# EAGLE design BLE_test (EAGLE 7.5.0)
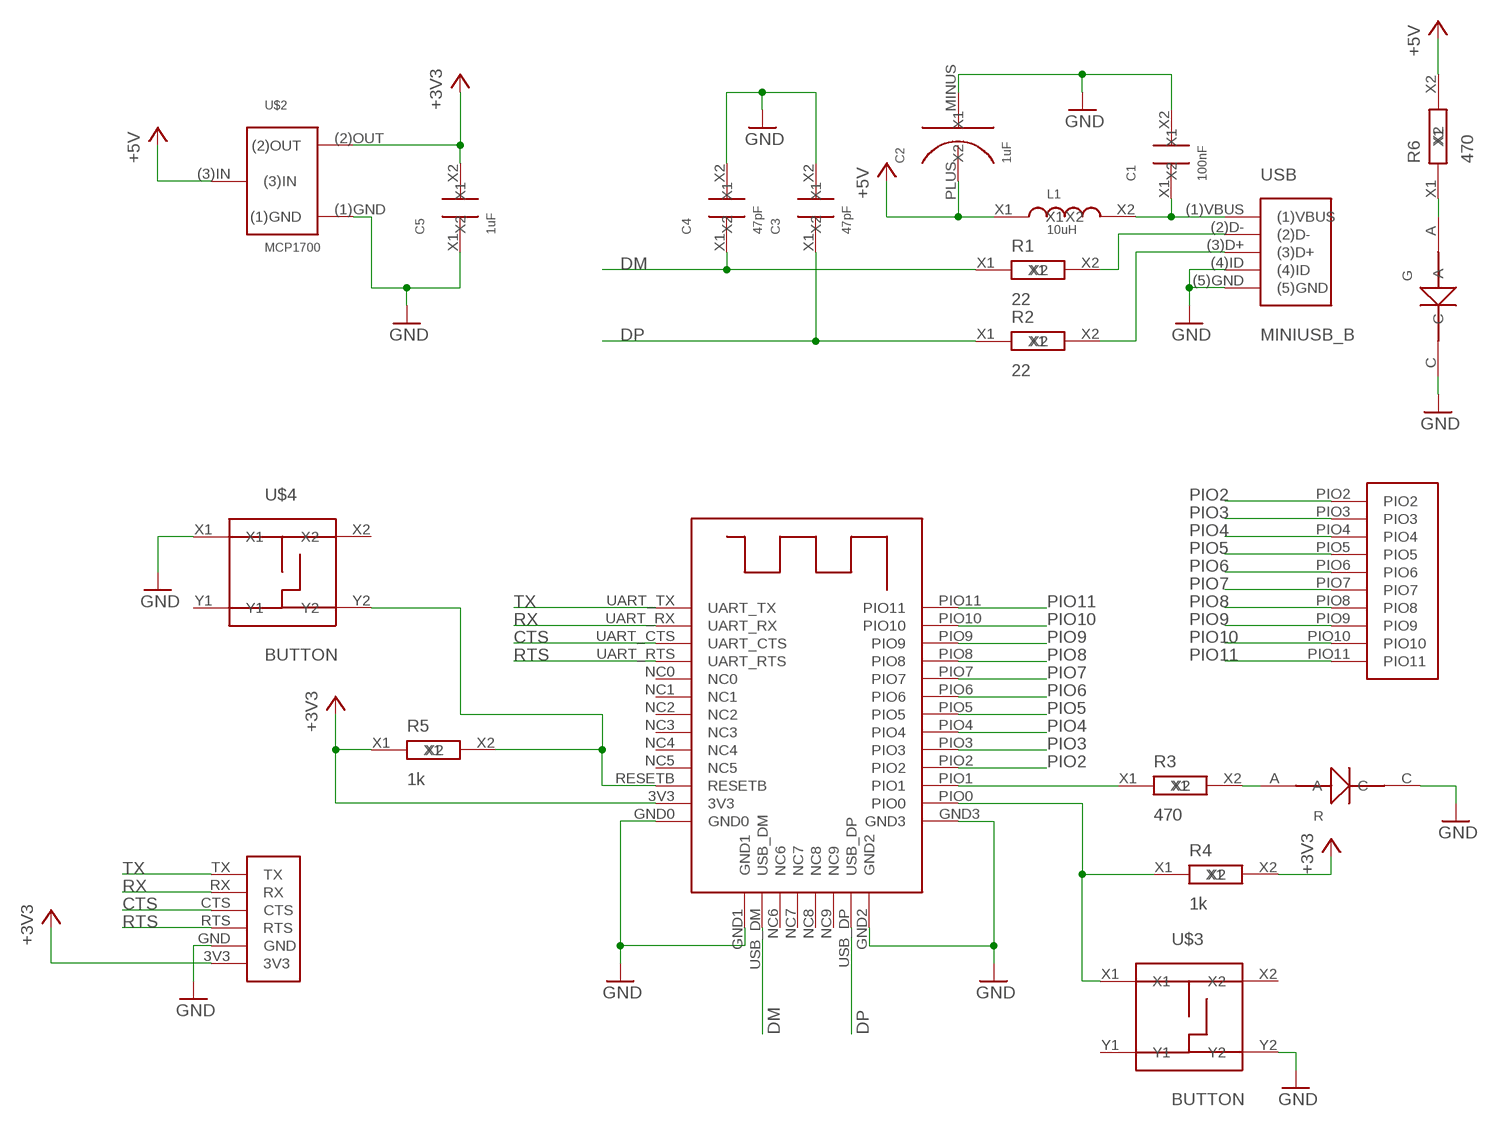
[diagram p0: schematic, sheet 1]

## Parts
C1  100nF  C_SMD_2.1X1.25  [SMD_2.1X1.25]
C2  1uF  C_SMD_TA_A  [C_SMD_TA_A]
C3  47pF  C_SMD_2.1X1.25  [SMD_2.1X1.25]
C4  47pF  C_SMD_2.1X1.25  [SMD_2.1X1.25]
C5  1uF  C_SMD_2.1X1.25  [SMD_2.1X1.25]
G  LED0805  [SMD0805]
L1  10uH  L_SMD_2.1X1.25  [SMD_2.1X1.25]
R  LED0805  [SMD0805]
R1  22  R_SMD_2.1X1.25  [SMD_2.1X1.25]
R2  22  R_SMD_2.1X1.25  [SMD_2.1X1.25]
R3  470  R_SMD_2.1X1.25  [SMD_2.1X1.25]
R4  1k  R_SMD_2.1X1.25  [SMD_2.1X1.25]
R5  1k  R_SMD_2.1X1.25  [SMD_2.1X1.25]
R6  470  R_SMD_2.1X1.25  [SMD_2.1X1.25]
U$1  BLE_HM10  [BLE_HM10]
U$2  MCP1700  [MCP1700]
U$3  BUTTON  [BUTTON]
U$4  BUTTON  [BUTTON]
U$5  PIN6  [PIN6]
U$7  PIO_10  [PIO_10]
USB  MINIUSB_B  [MINIUSB_B]

## Nets
+3V3: C5.X2 R4.X2 R5.X1 U$1.3V3 U$2.(2)OUT U$5.3V3
+5V: C2.PLUS(X1) L1.X1 R6.X2 U$2.(3)IN
CTS: U$1.UART_CTS U$5.CTS
DM: C4.X1 R1.X1 U$1.USB_DM
DP: C3.X1 R2.X1 U$1.USB_DP
GND: C1.X2 C2.MINUS(X2) C3.X2 C4.X2 C5.X1 G.C R.C U$1.GND0 U$1.GND1 U$1.GND2 U$1.GND3 U$2.(1)GND U$3.Y2 U$4.X1 U$5.GND USB.(4)ID USB.(5)GND
N$1: C1.X1 L1.X2 USB.(1)VBUS
N$2: R2.X2 USB.(3)D+
N$3: R1.X2 USB.(2)D-
N$4: R3.X1 U$1.PIO1
N$5: R3.X2 R.A
N$6: R4.X1 U$1.PIO0 U$3.X1
N$7: G.A R6.X1
N$9: R5.X2 U$1.RESETB U$4.Y2
PIO2: U$1.PIO2 U$7.PIO2
PIO3: U$1.PIO3 U$7.PIO3
PIO4: U$1.PIO4 U$7.PIO4
PIO5: U$1.PIO5 U$7.PIO5
PIO6: U$1.PIO6 U$7.PIO6
PIO7: U$1.PIO7 U$7.PIO7
PIO8: U$1.PIO8 U$7.PIO8
PIO9: U$1.PIO9 U$7.PIO9
PIO10: U$1.PIO10 U$7.PIO10
PIO11: U$1.PIO11 U$7.PIO11
RTS: U$1.UART_RTS U$5.RTS
RX: U$1.UART_RX U$5.RX
TX: U$1.UART_TX U$5.TX
Unconnected: U$1.NC0 U$1.NC1 U$1.NC2 U$1.NC3 U$1.NC4 U$1.NC5 U$1.NC6 U$1.NC7 U$1.NC8 U$1.NC9 U$3.X2 U$3.Y1 U$4.X2 U$4.Y1

## Library data of the parts
C1 C3-C5 = MyPowerComponents:C_SMD_2.1X1.25
C2 = MyAmSys:C_SMD_TA_A
G R = My_BLE:LED0805
L1 = MyPowerComponents:L_SMD_2.1X1.25
R1-R6 = MyPowerComponents:R_SMD_2.1X1.25
U$1 = My_BLE:BLE_HM10
U$2 = MyCMOSsensor:MCP1700
U$3 U$4 = My_STM32:BUTTON
U$5 = My_BLE:PIN6
U$7 = My_BLE:PIO_10
USB = MyCMOSsensor:MINIUSB_B

## Board
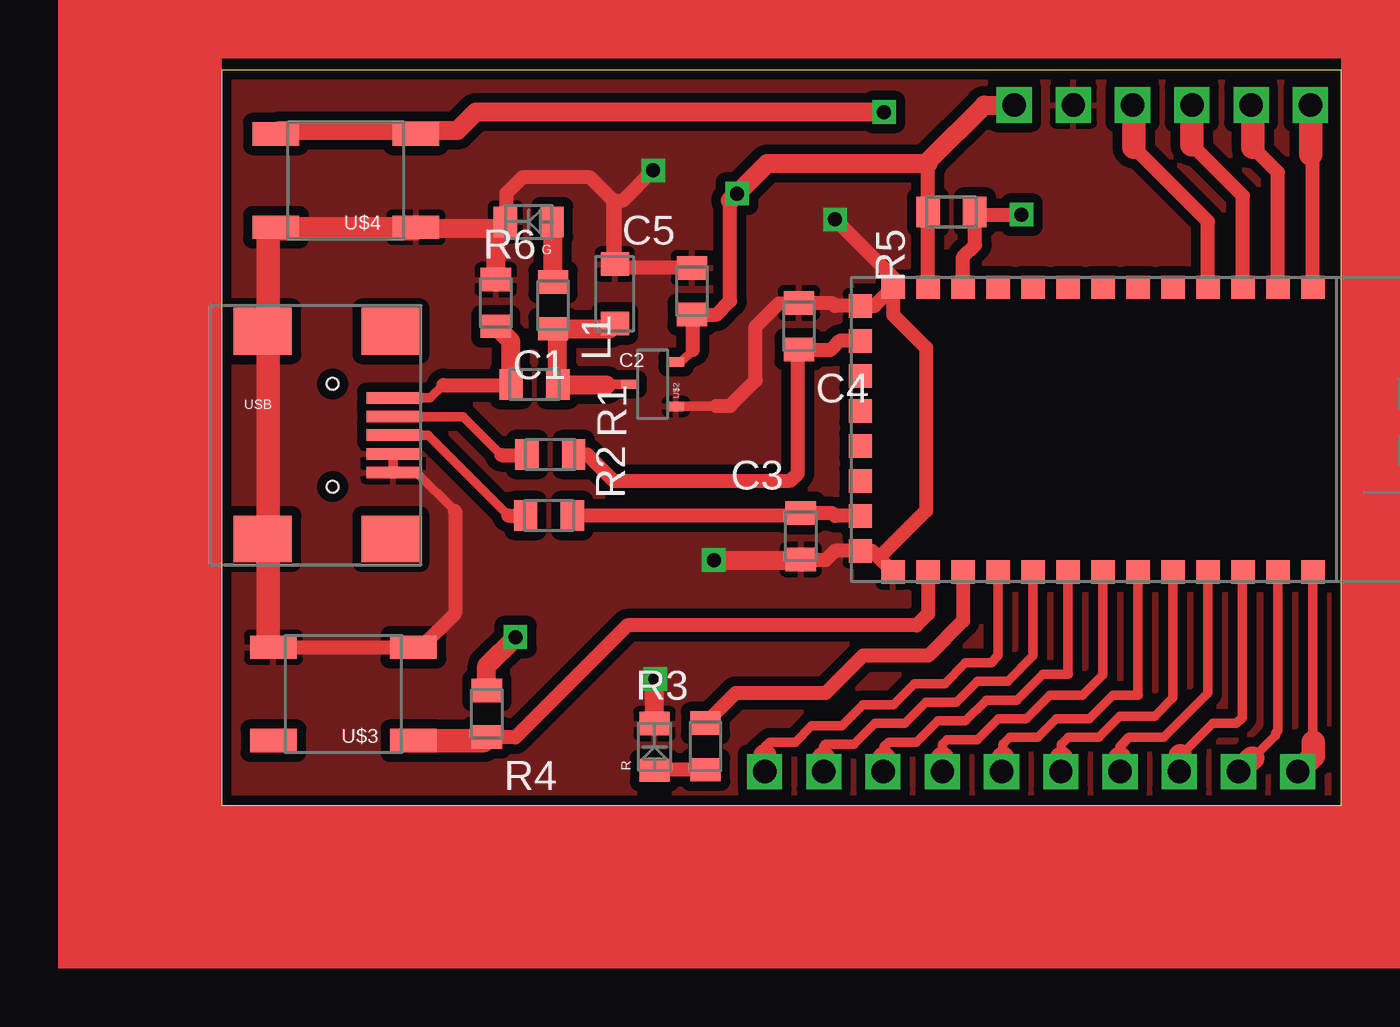
[diagram p1: board, top side]
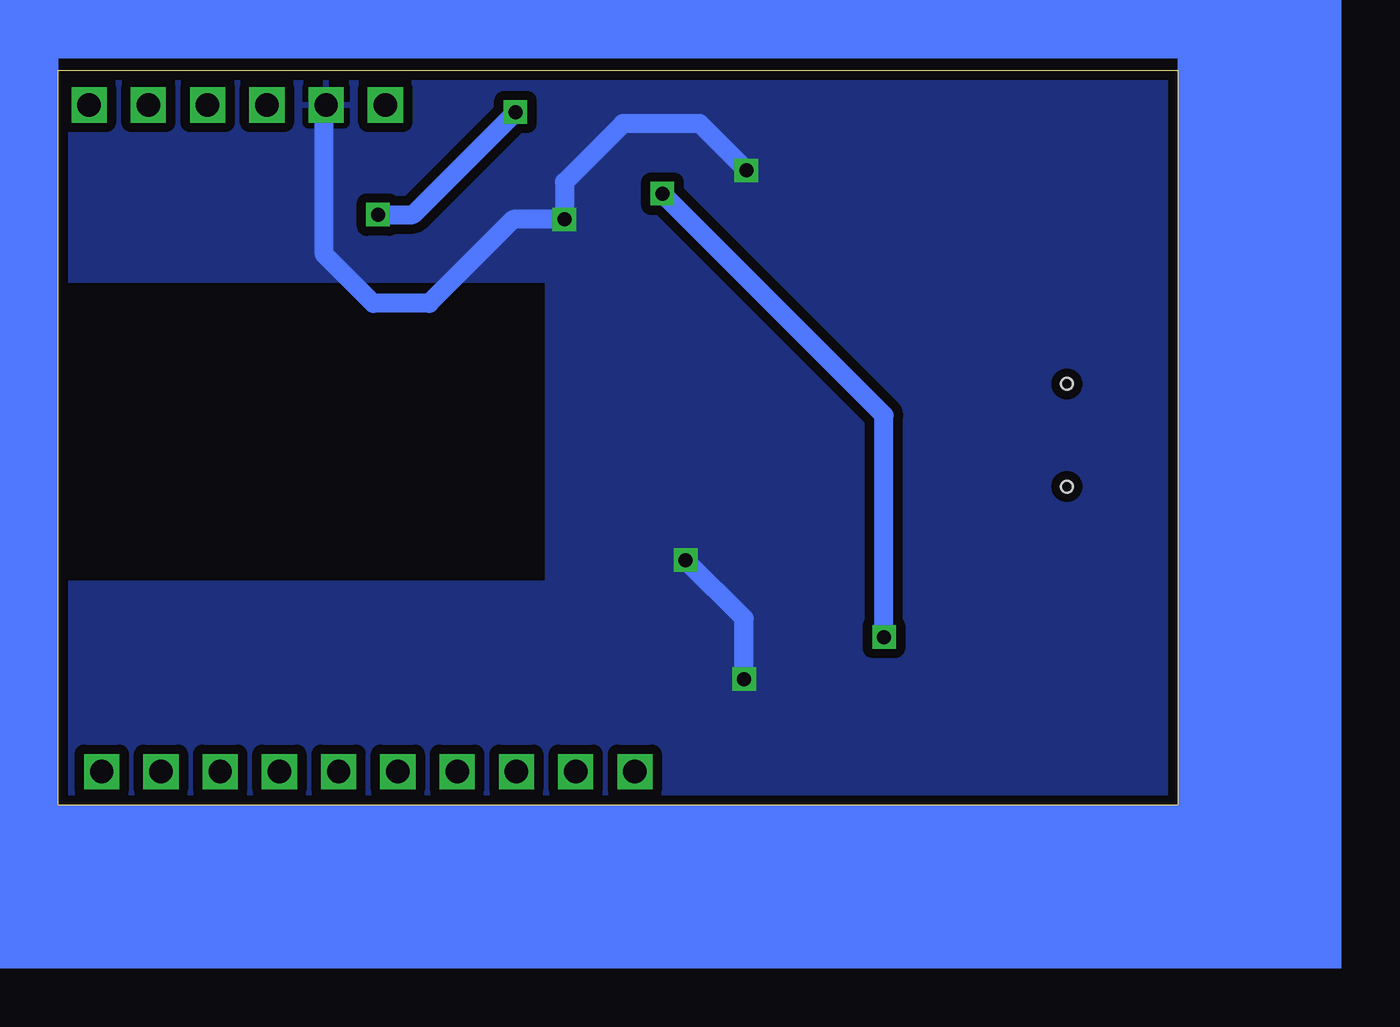
[diagram p2: board, bottom side, seen from below]

Size 48 x 31.5 mm. Coordinates in mm from the lower left corner, seen from the top.
Outline: 0,0 48,0 48,31.5 0,31.5 0,0
Copper layers (1*16): Top 0.035mm / dielectric 1.5mm / Bottom 0.035mm
Design rules "default *": minimum track width 10mil, minimum drill 24mil, track to track 8mil, track to pad 8mil, pad to pad 8mil, via to via 8mil, smd to smd 8mil, copper to edge 10mil, drill to drill 8mil, minimum pad ring 10mil, minimum via ring 8mil, stop-mask expansion 4mil, vias tented up to drill 0mil, thermal gap 10mil

### Footprints (pad centres in the part's own frame; a part is rotated, then mirrored left to right if it is on the bottom)
SMD_2.1X1.25 = smd 1.3 x 1: X1 0,1; X2 0,-1
C_SMD_TA_A = smd 1.2 x 1: MINUS 0,-1.27; PLUS 0,1.27
SMD0805 = smd 1 x 1.3: A -1,0; C 1,0
BLE_HM10 = smd 1 x 1: 3V3 0.4,-17; GND0 0.4,-18.5; GND1 1.2,-19.9; GND2 11.7,-19.9; GND3 12.6,-18.5; NC0 0.4,-6.5; NC1 0.4,-8; NC2 0.4,-9.5; NC3 0.4,-11; NC4 0.4,-12.5; NC5 0.4,-14; NC6 4.2,-19.9; NC7 5.7,-19.9; NC8 7.2,-19.9; NC9 8.7,-19.9; PIO0 12.6,-17; PIO1 12.6,-15.5; PIO2 12.6,-14; PIO3 12.6,-12.5; PIO4 12.6,-11; PIO5 12.6,-9.5; PIO6 12.6,-8; PIO7 12.6,-6.5; PIO8 12.6,-5; PIO9 12.6,-3.5; PIO10 12.6,-2; PIO11 12.6,-0.5; RESETB 0.4,-15.5; UART_CTS 0.4,-3.5; UART_RTS 0.4,-5; UART_RX 0.4,-2; UART_TX 0.4,-0.5; USB_DM 2.7,-19.9; USB_DP 10.2,-19.9
MCP1700 = smd 0.4 x 0.7: (1)GND -0.95,-2; (2)OUT 0.95,-2; (3)IN 0,0
BUTTON = smd 2 x 1: X1 -3,2; X2 3,2; Y1 -3,-2; Y2 3,-2
PIN6 = drill 1 square: 3V3 0,-7.62; CTS 0,0; GND 0,-5.08; RTS 0,-2.54; RX 0,2.54; TX 0,5.08
PIO_10 = drill 1 square: PIO2 0,12.7; PIO3 0,10.16; PIO4 0,7.62; PIO5 0,5.08; PIO6 0,2.54; PIO7 0,0; PIO8 0,-2.54; PIO9 0,-5.08; PIO10 0,-7.62; PIO11 0,-10.16
MINIUSB_B = smd 2.3 x 0.5: (1)VBUS 0,1.6; (2)D- 0,0.8; (3)D+ 0,0; (4)ID 0,-0.8; (5)GND 0,-1.6 | smd 2.5 x 2: PG1 -0.1,-4.45; PG2 -5.6,-4.45; PG3 -5.6,4.45; PG4 -0.1,4.45 | hole 0.5: -2.6,2.2; -2.6,-2.2

### Placement (x,y rotation side)
C1  11.76,21.52 180 top
C2  16.86,21.91 180 top
C3  24.83,11.52 0 top
C4  24.75,20.52 180 top
C5  20.17,22.02 0 top
G  13.17,24.99 180 top
L1  13.41,18.02 270 top
R  18.56,2.49 90 top
R1  14.09,15.02 270 top
R2  14.03,12.41 270 top
R3  20.75,2.51 0 top
R4  11.37,3.91 180 top
R5  31.29,25.41 90 top
R6  14.21,21.41 0 top
U$1  47.29,22.59 270 top
U$2  17.48,18.03 90 top
U$3  5.22,4.76 180 top
U$4  5.33,26.76 180 top
U$5  41.6,30 270 top
U$7  35.98,1.43 90 top
USB  7.36,15.85 0 top

### Tracks (layer width: path | path; a pad name or v marks a point on that pad's centre or on a via)
+3V3  (via drill 0.6)
  Top 0.406: U$2.(2)OUT 19.68,18.98 20.2,19.5
  Top 0.61: 20.2,19.5 20.2,20.99 C5.X2 21.22,21.02 21.8,21.6 21.8,25.9 | U$1.3V3 R5.X1 30.29,27.49 30.3,27.5
  Top 0.813: 30.3,27.5 30.3,27.6 32.7,30 U$5.3V3 | 21.8,25.9 v22.1,26.2 23.4,27.5 30.28,27.5 30.29,27.49 | R4.X2 11.37,5.97 v12.6,7.2
  Bottom 0.813: v12.6,7.2 12.6,16.7 v22.1,26.2
+5V
  Top 0.406: U$2.(3)IN 16.53,18.03 16.5,18
  Top 0.813: C2.PLUS 16.63,20.41 R6.X2 14.41,20.21 L1.X1 14.43,18 16.5,18
CTS
  Top 0.61: U$1.UART_CTS 43.79,26.11 41.6,28.3
  Top 1.016: 41.6,28.3 U$5.CTS
DM
  Top 0.61: U$1.USB_DM 26.49,19.89 26.1,19.5 24.77,19.5 C4.X1 24.7,19.47 24.7,14.2 24.4,13.9 16.8,13.9 15.68,15.02 R1.X1
DP
  Top 0.61: U$1.USB_DP 26.31,12.39 26.2,12.5 24.85,12.5 C3.X1 24.72,12.41 R2.X1
GND  (via drill 0.6)
  Top 0.406: U$2.(1)GND 21.18,17.08 21.2,17.1 | 10,12.6 8.35,14.25 USB.(5)GND USB.(4)ID | 10,8.2 8.5,6.7 2.1,6.7 2,6.8 | 22.9,20.5 22.9,18.1 22.8,18.1 21.8,17.1
  Top 0.61: C3.X2 24.85,10.5 25.9,10.5 26.29,10.89 U$1.GND2 27.89,10.89 28.19,10.59 | 28.19,10.59 U$1.GND3 | U$1.GND0 27.99,21.39 U$1.GND1 26.31,21.39 26.2,21.5 24.77,21.5 C4.X2 24.73,21.5 23.9,21.5 22.9,20.5 22.9,18.2 21.8,17.1 21.2,17.1 | G.C 12.2,25.02 12.2,26.2 12.9,26.9 15.8,26.9 16.86,25.84 C2.MINUS 17.02,23.02 C5.X1 16.98,23.02 16.8,23.2 16.8,25.8 16.9,25.9 17.2,25.9 v18.5,27.2 | U$3.Y2 8.56,6.76 10,8.2 10,12.6 | U$1.GND0 28.79,21.01 30.2,19.6 30.2,12.6 28.19,10.59 | U$1.GND0 28.79,22.61 v26.3,25.1
  Top 0.813: C1.X2 11.76,24.58 G.C 12.09,24.99 11.8,24.7 8.39,24.7 U$4.X1 | R.C 18.56,5.36 v18.6,5.4 | v21.1,10.5 24.81,10.5 C3.X2
  Top 1.016: 2,6.8 2,24.6 2.1,24.7 8.27,24.7 U$4.X1
  Bottom 0.813: v18.6,5.4 18.6,8 v21.1,10.5 | U$5.GND 36.6,29.92 36.6,23.6 34.5,21.5 32.1,21.5 28.5,25.1 v26.3,25.1 26.3,26.7 23.8,29.2 20.5,29.2 v18.5,27.2
  pour Bottom (isolate 0.406): 0,0 48,0 48,9.5 27,9.5 27,22.5 48,22.5 48,31.5 0,31.5
  pour Top (isolate 0.406): 0,0 48,0 48,9.5 27,9.5 27,22.5 48,22.5 48,31.5 0,31.5
N$1
  Top 0.406: USB.(1)VBUS 8.95,17.45 9.5,18
  Top 0.61: 9.5,18 12.39,18 L1.X2
  Top 0.813: L1.X2 12.41,19.87 C1.X1
N$2
  Top 0.406: USB.(3)D+ 8.85,15.85 12.3,12.4
  Top 0.61: 12.3,12.4 R2.X2
N$3
  Top 0.406: USB.(2)D- 10.35,16.65 12,15
  Top 0.61: 12,15 13.07,15 R1.X2
N$4
  Top 0.61: U$1.PIO1 31.79,7.89 30.3,6.4 27.5,6.4 25.9,4.8 22.04,4.8 R3.X1
N$5
  Top 0.61: R3.X2 18.58,1.51 R.A
N$6
  Top 0.61: U$1.PIO0 30.29,8.19 29.8,7.7 17.4,7.7 12.6,2.9 R4.X1
  Top 1.016: U$3.X1 11.22,2.76 R4.X1
N$7
  Top 0.813: R6.X1 14.21,24.95 G.A
N$9  (via drill 0.6)
  Top 0.61: U$1.RESETB 31.79,23.49 32.3,24 32.3,25.3 | 32.3,25.3 R5.X2 | 32.3,25.3 v34.3,25.3
  Top 0.813: v28.4,29.7 10.9,29.7 10.1,28.9 2.47,28.9 U$4.Y2
  Bottom 0.813: v34.3,25.3 32.8,25.3 v28.4,29.7
PIO2
  Top 0.406: U$1.PIO2 33.29,6.39 33,6.1 31.9,6.1 31,5.2 29.7,5.2 28.8,4.3 27.5,4.3 26.6,3.4 25.3,3.4 24.6,2.7 23.5,2.7 23.3,2.5 23.3,2.1
  Top 1.016: 23.3,2.1 23.3,1.45 U$7.PIO2
PIO3
  Top 0.406: U$1.PIO3 34.79,6.39 33.7,5.3 32.4,5.3 31.5,4.4 30.2,4.4 29.3,3.5 28,3.5 27.1,2.6 25.9,2.6 25.8,2.5 25.8,2
  Top 1.016: 25.8,2 25.8,1.45 U$7.PIO3
PIO4
  Top 0.406: U$1.PIO4 36.29,5.61 36.3,5.6 35.2,5.6 34.1,4.5 32.8,4.5 31.9,3.6 30.7,3.6 29.8,2.7 28.6,2.7 28.4,2.5 28.4,2
  Top 1.016: 28.4,2 28.4,1.47 U$7.PIO4
PIO5
  Top 0.406: U$1.PIO5 37.79,5.59 36.9,4.7 35.5,4.7 34.5,3.7 33.3,3.7 32.4,2.8 31.1,2.8 30.9,2.6 30.9,2
  Top 1.016: 30.9,2 U$7.PIO5
PIO6
  Top 0.406: U$1.PIO6 39.29,4.71 39.3,4.7 38.2,4.7 37.2,3.7 35.8,3.7 35,2.9 33.8,2.9 33.5,2.6 33.5,2
  Top 1.016: 33.5,2 33.5,1.49 U$7.PIO6
PIO7
  Top 0.406: U$1.PIO7 40.79,4.59 40,3.8 38.5,3.8 37.6,2.9 36.3,2.9 36,2.6 36,2
  Top 1.016: 36,2 36,1.45 U$7.PIO7
PIO8
  Top 0.406: U$1.PIO8 42.29,4.79 40.4,2.9 38.9,2.9 38.5,2.5 38.5,2
  Top 1.016: 38.5,2 38.5,1.45 U$7.PIO8
PIO9
  Top 0.406: 41.1,2.1 41,2.1 41,2 42.5,3.5 43.5,3.5 43.75,3.75 43.75,9.95 U$1.PIO9
  Top 1.016: 41.1,2.1 41.1,1.47 U$7.PIO9
PIO10
  Top 0.406: U$1.PIO10 45.29,3.19 45.2,3.1 45.2,3 44.2,2
  Top 1.016: 44.2,2 44.17,2 U$7.PIO10
PIO11
  Top 0.406: U$1.PIO11 46.79,2.71 46.8,2.7
  Top 1.016: 46.8,2.7 46.8,2.09 U$7.PIO11
RTS
  Top 0.61: U$1.UART_RTS 42.29,25.01 39.1,28.2
  Top 1.016: 39.1,28.2 39.1,29.96 U$5.RTS
RX
  Top 0.61: U$1.UART_RX 45.29,27.11 44.2,28.2
  Top 1.016: 44.2,28.2 44.2,29.94 U$5.RX
TX
  Top 0.61: U$1.UART_TX 46.79,27.81 46.7,27.9
  Top 1.016: 46.7,27.9 46.7,29.98 U$5.TX
(copper drawn outside any net)
  shapes: Bottom area x4, Top area x5